# Altium schematic sheet 12-Power.SchDoc
size B; SheetNumber: 12; SheetTotal: 16
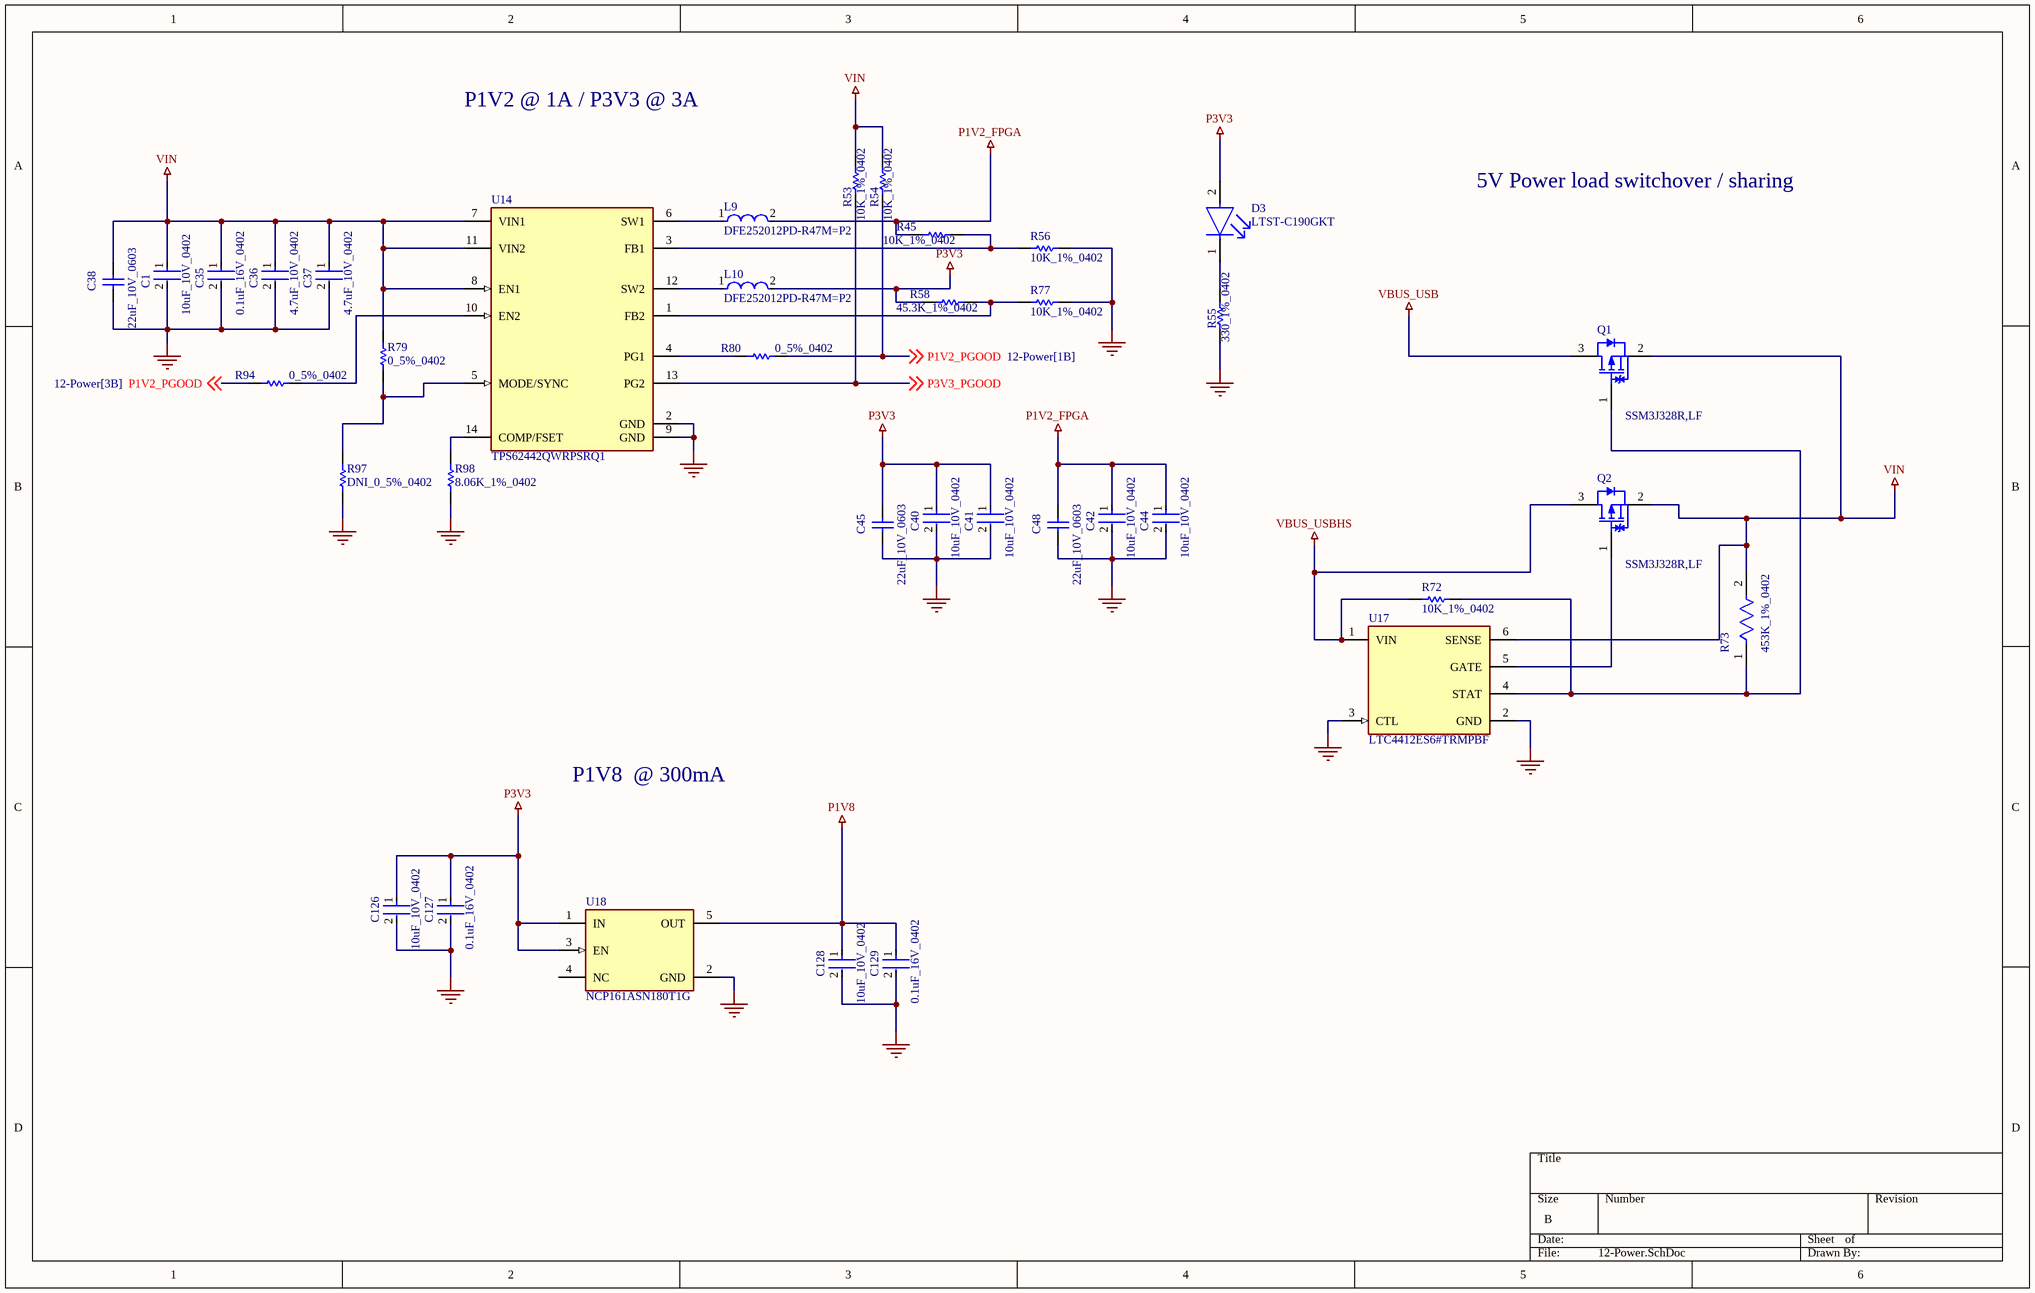
[diagram p0: 12-Power.SchDoc]

## Parts
C1  10uF_10V_0402  [FP-CL05A106MP5NUNC-MFG]
C35  0.1uF_16V_0402  [FP-C0402-BB-MFG]
C36  4.7uF_10V_0402  [FP-C1005-050-0_15-MFG]
C37  4.7uF_10V_0402  [FP-C1005-050-0_15-MFG]
C38  22uF_10V_0603  [CAPC1608X100X20ML10]
C40  10uF_10V_0402  [FP-CL05A106MP5NUNC-MFG]
C41  10uF_10V_0402  [FP-CL05A106MP5NUNC-MFG]
C42  10uF_10V_0402  [FP-CL05A106MP5NUNC-MFG]
C44  10uF_10V_0402  [FP-CL05A106MP5NUNC-MFG]
C45  22uF_10V_0603  [CAPC1608X100X20ML10]
C48  22uF_10V_0603  [CAPC1608X100X20ML10]
C126  10uF_10V_0402  [FP-CL05A106MP5NUNC-MFG]
C127  0.1uF_16V_0402  [FP-C0402-BB-MFG]
C128  10uF_10V_0402  [FP-CL05A106MP5NUNC-MFG]
C129  0.1uF_16V_0402  [FP-C0402-BB-MFG]
D3  LTST-C190GKT  [FP-LTST-C190GKT-MFG]
L9  DFE252012PD-R47M=P2  [FP-DFE252012C-IPC_A]
L10  DFE252012PD-R47M=P2  [FP-DFE252012C-IPC_A]
Q1  SSM3J328R,LF  [TOSH-SOT-23F_V]
Q2  SSM3J328R,LF  [TOSH-SOT-23F_V]
R45  10K_1%_0402  [RESC1005X40X25NL10T10]
R53  10K_1%_0402  [RESC1005X40X25NL10T10]
R54  10K_1%_0402  [RESC1005X40X25NL10T10]
R55  330_1%_0402  [RESC1005X40X25NL10T10]
R56  10K_1%_0402  [RESC1005X40X25NL10T10]
R58  45.3K_1%_0402  [RESC0402(1005)_L]
R72  10K_1%_0402  [RESC1005X40X25NL10T10]
R73  453K_1%_0402  [FP-RC1005-IPC_B]
R77  10K_1%_0402  [RESC1005X40X25NL10T10]
R79  0_5%_0402  [RESC1005X40X25NL05T10]
R80  0_5%_0402  [RESC1005X40X25NL05T10]
R94  0_5%_0402  [RESC1005X40X25NL05T10]
R97  DNI_0_5%_0402  [RESC1005X40X25NL05T10]  (no BOM)
R98  8.06K_1%_0402  [RESC1005X40X25ML05T05]
U14  TPS62442QWRPSRQ1  [FP-RQR0014A-MFG]
U17  LTC4412ES6#TRMPBF  [FP-S6-6-05-08-1636-IPC_C]
U18  NCP161ASN180T1G  [FP-527AH-MFG]

## Nets
GND: C1.2 C35.2 C36.2 C37.2 C38.1 C40.2 C41.2 C42.2 C44.2 C45.1 C48.1 C126.2 C127.2 C128.2 C129.2 R55.1 R56.1 R77.1 R97.1 R98.1 U14.2(GND) U14.9(GND) U17.2(GND) U17.3(CTL) U18.2(GND)
P1V2_FPGA: C42.1 C44.1 C48.2 L9.2 R45.2
P1V8: C128.1 C129.1 U18.5(OUT)
P3V3: C40.1 C41.1 C45.2 C126.1 C127.1 D3.2(A) L10.2 R58.1 U18.1(IN) U18.3(EN)
VBUS_USB: Q1.3(D)
VBUS_USBHS: Q2.3(D) R72.1 U17.1(VIN)
VIN: C1.1 C35.1 C36.1 C37.1 C38.2 Q1.2(S) Q2.2(S) R53.2 R54.2 R73.2 R79.2 U14.7(VIN1) U14.8(EN1) U14.11(VIN2) U17.6(SENSE)
P1V2_PGOOD: R54.1 R80.2 R94.1 ; off-sheet P1V2_PGOOD
P3V3_PGOOD: R53.1 U14.13(PG2) ; off-sheet P3V3_PGOOD
NetD3_1: D3.1(C) R55.2
NetL9_1: L9.1 U14.6(SW1)
NetL10_1: L10.1 U14.12(SW2)
NetQ1_1: Q1.1(G) R72.2 R73.1 U17.4(STAT)
NetQ2_1: Q2.1(G) U17.5(GATE)
NetR45_1: R45.1 R56.2 U14.3(FB1)
NetR58_2: R58.2 R77.2 U14.1(FB2)
NetR79_1: R79.1 R97.2 U14.5(MODE/SYNC)
NetR80_1: R80.1 U14.4(PG1)
NetR94_2: R94.2 U14.10(EN2)
NetR98_2: R98.2 U14.14(COMP/FSET)

Not connected (* = marked no-connect by the designer): U18 4(NC)

## Notes on the sheet
- P1V2 @ 1A / P3V3 @ 3A
- 5V Power load switchover / sharing
- P1V8  @ 300mA

## Library data of the parts
C1 C40-C42 C44 C126 C128 = CMP-13271-000002-1: CAP CER 10UF 10V X5R 0402; Manufacturer Part Number: CL05A106MP5NUNC; Manufacturer: Samsung; Temperature Coefficient: 15%; Tolerance: 20%; Material: Ceramic; Octopart: https://octopart.com/cl05a106mp5nunc-samsung-22457395; Voltage Rating: 10V; RoHS: TRUE; Value: 10uF; Height: 0.7mm; Digikey Description: CAP CER 10UF 10V X5R 0402; Automotive: No; Package: CL05A106MP5NUNC; Device Class L1: Passive Components; Capacitance: 10uF; Temperature Range High: +85°C; ComponentLink2Description: Datasheet; Device Class L2: Capacitors; Temperature Characteristic: X5R; Temperature: -55°C to +85°C; ComponentLink2URL: http://www.samsungsem.com/kr/support/product-search/mlcc/__icsFiles/afieldfile/2019/05/10/19-CL05A106MP5NUNC.pdf; Device Class L3: Ceramic Capacitors; Category: Cap; Temperature Range Low: -55°C; Ipc Land Pattern Name: CAPC10050X50; Lead Free: Yes
C35 C127 C129 = CMP-1034-02068-3: CAP CER 0.1UF 16V 5% X7R 0402; Manufacturer: Kemet; Manufacturer Part Number: C0402C104J4RACTU; Value: 0.10 μF; Temperature Coefficient: 15%; Tolerance: 0.05; Material: Ceramic; ComponentLink2URL: https://content.kemet.com/datasheets/KEM_C1002_X7R_SMD.pdf; Automotive: No; Device Class L2: Capacitors; Temperature: -55°C to +125°C; RoHS: TRUE; Voltage Rating: 16 V; ComponentLink2Description: Datasheet; Device Class L3: Ceramic Capacitors; Temperature Range Low: -55°C; Ipc Land Pattern Name: CAPC10050X50; Device Class L1: Passive Components; Temperature Range High: +125°C; Package: C0402-BB; Capacitance: 0.10 μF; Category: Cap; Mouser Description: CAP CER 0.1UF 16V X7R 0402; Height: 0.55mm; Digikey Description: CAP CER 0.1UF 16V 5% X7R 0402; Octopart: https://octopart.com/c0402c104j4ractu-kemet-12573893; Temperature Characteristic: X7R; Lead Free: Yes
C36 C37 = CMP-2000-05997-2: CAP CER 4.7UF 10V X5R 0402; Dielectric Material: Ceramic; Tolerance: 10%; Series: C; Package Quantity: 10000; Max Operating Temperature: 85°C; Case Code (Imperial): 0402; Lead Free: Lead Free; Voltage Rating (DC): 10V; Packaging: Cut Tape; Voltage Rating: 10V; Min Operating Temperature: -55°C; Dielectric: X5R; Thickness: 0.022inch; Width: 0.02inch; Case/Package: 0402; Case Code (Metric): 1005; Capacitance: 4.7uF; Length: 0.039inch; RoHS Compliant: Yes; REACH SVHC: No SVHC; Mount: Surface Mount
C38 C45 C48 = CMP-2000-05441-1: Chip Capacitor, 22 uF, +/- 20%, 10 V, -55 to 85 degC, 0603 (1608 Metric), RoHS, Tape and Reel; Manufacturer: TDK; PCN Part Number: MLCCPartNumberChange30/Nov/2012; Voltage - Rated: 10V; Product Training Modules: CSeriesGeneralApplicationsSEAT,CCV,andTVCLDesignToolsGuidetoReplacinganElectrolyticCapacitorwithanMLCC; Other Names: 445-9077-1; Design Resources: 20WNon-IsolatedBuckLEDDriverUsingPLLNK460KG; Online Catalog: CSeries,GeneralPurpose; Capacitance: 22µF; Temperature Coefficient: X5R; Kits: 445-9014-KIT-ND-KITMLCC100PF-22UF060310-50V; Packaging: CutTape(CT); Standard Package: 1; Package / Case: 0603(1608Metric); Lead Style: -; Features: -; Ratings: -; Operating Temperature: -55degC~85degC; Applications: GeneralPurpose; Package Reference: 603; Datasheet URL: http://download.siliconexpert.com/pdfs/2015/4/21/15/54/45/779/tdk_/manual/37024850441143360mlcc_commercial_general_en.pdf; Datasheet Version: Mar-15; Mounting Type: SurfaceMount,MLCC; Lead Spacing: -; Size / Dimension: 0.063"Lx0.031"W(1.60mmx0.80mm); Height - Seated (Max): -; Package Description: 2-Pin Surface Mount Device, Body 1.6 x 0.8 mm; Manufacturer URL: http://www.tdk.com/; RoHS Information: RoHSCertificate-MLCC; Tolerance: ±20%; Series: C; Thickness (Max): 0.035"(0.90mm); Family: CeramicCapacitors; Category: Capacitors
D3 = CMP-22017-000005-2: LED GREEN CLEAR CHIP SMD; Dominant Wavelength: 569nm; Reverse Voltage: 5V; Lens Color: Colorless; Viewing Angle: 130°; Voltage: 2V; Forward Current: 30mA; Power Dissipation: 100mW; Luminous Intensity: 6mcd; Number of LEDs: 1; Forward Voltage: 2.1V; Wavelength: 565nm; Test Current: 10mA; Min Operating Temperature: -55°C; Lens Style: Clear; Mount: Surface Mount; Width: 0.8mm; Packaging: Tape and Reel; Lens Transparency: Clear; Case Code (Metric): 1608; Depth: 0.8mm; Case Code (Imperial): 0603; Case/Package: 0603; Number of Pins: 2; Max Operating Temperature: 85°C; Lead Free: Lead Free; Number of Elements: 1; Length: 1.6mm; Height: 0.8mm; Package Quantity: 1; Power Rating: 100mW; Radiation Hardening: No; Illumination Color: Green; Color: Green
L9 L10 = CMP-06042-015149-1: Shielded Wirewound Inductor 0.47uH 20% 4000mA 0.027Ω 1008 (2520)
Q1 Q2 = CMP-2100-03686-1: TOSHIBA Field-Effect Transistor Silicon P-Channel MOS Type (U-MOS VI), 20 V, -55 to 125 degC, 3-Pin SOTFL, RoHS, Tape and Reel; Gate to Source Voltage (Vgs): 8V; Drain to Source Breakdown Voltage: -20V; Turn-Off Delay Time: 107ns; Continuous Drain Current (ID): 6A; Rds On Max: 29.8mOhm; Number of Elements: 1; Turn-On Delay Time: 32ns; Drain to Source Resistance: 47.4mOhm; Drain to Source Voltage (Vdss): 20V; Power Dissipation: 2W; Element Configuration: Single; Max Power Dissipation: 1W; Input Capacitance: 840pF; Manufacturer URL: http://www.toshiba.com/; Number of Pins: 3; Number of Channels: 1; Max Operating Temperature: 150degC; Min Operating Temperature: -55degC; Manufacturer: Toshiba; Mount: SurfaceMount; Package Description: 3-Pin Small Outline Transistor, Flat Lead, Body 2.9 x 1.8 mm, Pitch 0.95 mm; Radiation Hardening: No; Package Quantity: 3000; Package Reference: SOT-23F; RoHSCompliant: true; Package URL: https://toshiba.semicon-storage.com/ap-en/design-support/package/detail.SOT-23F.html; Packaging: TapeandReel; Datasheet Version: 41699.0; Case/Package: SOT-23-3; Datasheet URL: https://toshiba.semicon-storage.com/info/docget.jsp?did=2429&prodName=SSM3J328R
R45 R53 R54 R56 R72 R77 = CMP-2002-04694-1: Manufacturer: Bourns; Part Number: CR0402-FX-1002GLF
R55 = CMP-2002-05853-1: Manufacturer: Panasonic; Part Number: ERA-2AED331X
R58 = CMP-1011-00697-1: 45K3 0.063W 1% 0402 (1005 Metric)  SMD; Case-EIA: 0402; Case-Metric: 1005; Value: 45300.00 Ohm; Technology: SMT; Tolerance: 1 %; Power: 0.063 W
R73 = CMP-13261-000628-1: Res Thick Film 0402 453kΩ 1% 0.063W ±100ppm/°C Molded SMD T/R; Voltage Rating (DC): 50V; Max Power Dissipation: 63mW; Resistance: 453kR; Packaging: Tape and Reel; Number of Terminations: 2; Height: 0.016inch; Case Code (Imperial): 0402; Min Operating Temperature: -55°C; Tolerance: 1%; Features: Moisture Resistant; Length: 0.039inch; Power Rating: 63mW; Composition: Thick Film; Radiation Hardening: No; Temperature Coefficient: 100ppm/°C; Lead Free: Lead Free; Case Code (Metric): 1005; Width: 0.02inch; Max Operating Temperature: 155°C; Contact Plating: Tin; Case/Package: 0402
R79 R80 R94 R97 = CMP-2002-06457-1: Manufacturer: Panasonic; Part Number: ERJ-U020R00X
R98 = CMP-2002-00253-3: Chip Resistor, 8.06 KOhm, +/- 1%, 63 mW, -55 to 155 degC, 0402 (1005 Metric), RoHS, Tape and Reel; PartNumber: CRCW04028K06FKED; Manufacturer: Basic Passives; Case\/Package: 0402; Power Rating: 63 mW; Voltage Rating: 50 V; PackageReference: 0402; Radiation Hardening: No; Package Quantity: 10000; Height: 0.35 mm; Packaging: Tape and Reel; Mount: Surface Mount; Length: 1 mm; Weight: 2.3E-05oz; Case Code (Metric): 1005; DatasheetVersion: 06/2012; Pins: 2; Min Operating Temperature: -55 degC; Case Code (Imperial): 0402; REACH SVHC: Unknown; Tolerance: 1%; Mounting Technology: Surface Mount; ComponentLink1URL: http://www.vishay.com/; ComponentLink2URL: http://www.vishay.com/docs/20035/dcrcwe3.pdf; ComponentLink2Description: Datasheet; Resistance: 8.06 KOhm; Max Operating Temperature: 155 degC; ComponentLink1Description: Manufacturer URL; Width: 0.5 mm; RoHSCompliant: true; PackageDescription: 2-Pin Surface Mount Device, Body 1 x 0.5 mm
U14 = CMP-04918-000654-1: Adjustable-Frequency Dual Step-Down Converter, 2.7-6V VIN, 0.6-5.5V 2A VOUT, VQFN-HR14
U17 = CMP-0479-00425-2: IC OR CTRLR SRC SELECT TSOT23-6; Min Supply Voltage: 2.5V; Max Supply Voltage: 28V; Turn-On Delay Time: 110us; Number of Channels: 1; Lead Free: Lead Free; Length: 2.9mm; Radiation Hardening: No; RoHS Compliant: Yes; Package Quantity: 1; Min Operating Temperature: -40°C; Series: PowerPath™; Packaging: Tape and Reel; Width: 1.75mm; Height: 0.9mm; Number of Pins: 6; Max Operating Temperature: 85°C; Number of Outputs: 1; Case/Package: TSOT; REACH SVHC: No SVHC
U18 = CMP-00278-92192183-1: NCP161ASN180T1G LDO Regulator, 450 mA, Ultra-High PSRR, Ultra-Low Noise 1.8V, SOT23-5L, Active Discharge; Nominal Supply Current: 18µA; Output Type: Fixed; Number of Outputs: 1; Accuracy: 2%; Max Supply Voltage: 5.5V; Dropout Voltage: 365mV; Min Supply Voltage: 2.8V; Max Junction Temperature (Tj): 150°C; Output Current: 450mA; Output Voltage: 1.8V; Schedule B: 8542390000; Lifecycle Status: Production; NexarPartId: 92192183; Height: 1.45mm; Case/Package: SOT-23-5; RoHS: Compliant; Number of Channels: 1; Max Operating Temperature: 150°C; Manufacturer Lifecycle Status: ACTIVE